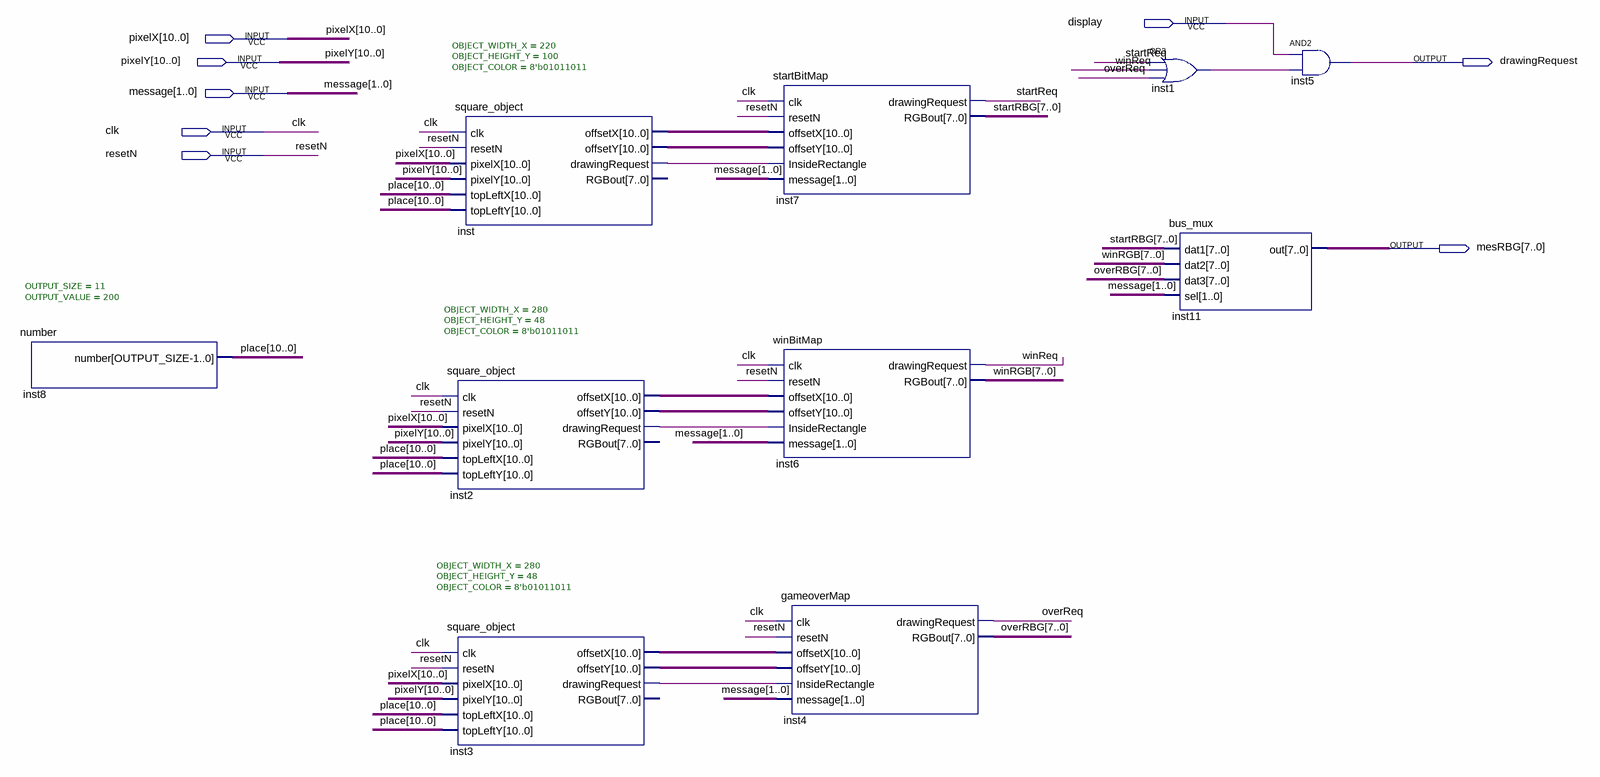
[diagram p0: schematic sheet]
// Quartus schematic messages.bdf as structural Verilog: 10 symbols, 8 pins
module messages (
  input  display,
  input  [10:0] pixelX,
  input  [10:0] pixelY,
  input  [1:0] message,
  input  clk,
  input  resetN,
  output drawingRequest,
  output [7:0] mesRBG
);

  wire inst1_out, inst2_drawingrequest, inst3_drawingrequest, inst_drawingrequest, overReq, startReq, winReq;
  wire [7:0] overRBG, startRBG, winRGB;
  wire [10:0] inst2_offsetx, inst2_offsety, inst3_offsetx, inst3_offsety, inst_offsetx, inst_offsety, place;

  number #(.OUTPUT_SIZE(11), .OUTPUT_VALUE(200)) inst8 (.number(place));
  square_object #(.OBJECT_WIDTH_X(220), .OBJECT_HEIGHT_Y(100), .OBJECT_COLOR(8'b01011011)) inst (
    .clk(clk), .resetN(resetN), .pixelX(pixelX), .pixelY(pixelY), .topLeftX(place), .topLeftY(place),
    .offsetX(inst_offsetx), .offsetY(inst_offsety), .drawingRequest(inst_drawingrequest));  // open: RGBout
  square_object #(.OBJECT_WIDTH_X(280), .OBJECT_HEIGHT_Y(48), .OBJECT_COLOR(8'b01011011)) inst2 (
    .clk(clk), .resetN(resetN), .pixelX(pixelX), .pixelY(pixelY), .topLeftX(place), .topLeftY(place),
    .offsetX(inst2_offsetx), .offsetY(inst2_offsety), .drawingRequest(inst2_drawingrequest));  // open: RGBout
  square_object #(.OBJECT_WIDTH_X(280), .OBJECT_HEIGHT_Y(48), .OBJECT_COLOR(8'b01011011)) inst3 (
    .clk(clk), .resetN(resetN), .pixelX(pixelX), .pixelY(pixelY), .topLeftX(place), .topLeftY(place),
    .offsetX(inst3_offsetx), .offsetY(inst3_offsety), .drawingRequest(inst3_drawingrequest));  // open: RGBout
  startBitMap inst7 (
    .clk(clk), .resetN(resetN), .offsetX(inst_offsetx), .offsetY(inst_offsety),
    .InsideRectangle(inst_drawingrequest), .message(message), .drawingRequest(startReq), .RGBout(startRBG));
  winBitMap inst6 (
    .clk(clk), .resetN(resetN), .offsetX(inst2_offsetx), .offsetY(inst2_offsety),
    .InsideRectangle(inst2_drawingrequest), .message(message), .drawingRequest(winReq), .RGBout(winRGB));
  gameoverMap inst4 (
    .clk(clk), .resetN(resetN), .offsetX(inst3_offsetx), .offsetY(inst3_offsety),
    .InsideRectangle(inst3_drawingrequest), .message(message), .drawingRequest(overReq), .RGBout(overRBG));
  or inst1 (inst1_out, startReq, winReq, overReq);
  bus_mux inst11 (.dat1(startRBG), .dat2(winRGB), .dat3(overRBG), .sel(message), .out(mesRBG));
  and inst5 (drawingRequest, display, inst1_out);
endmodule
